# EAGLE schematic Myduino (EAGLE 7.6.0)
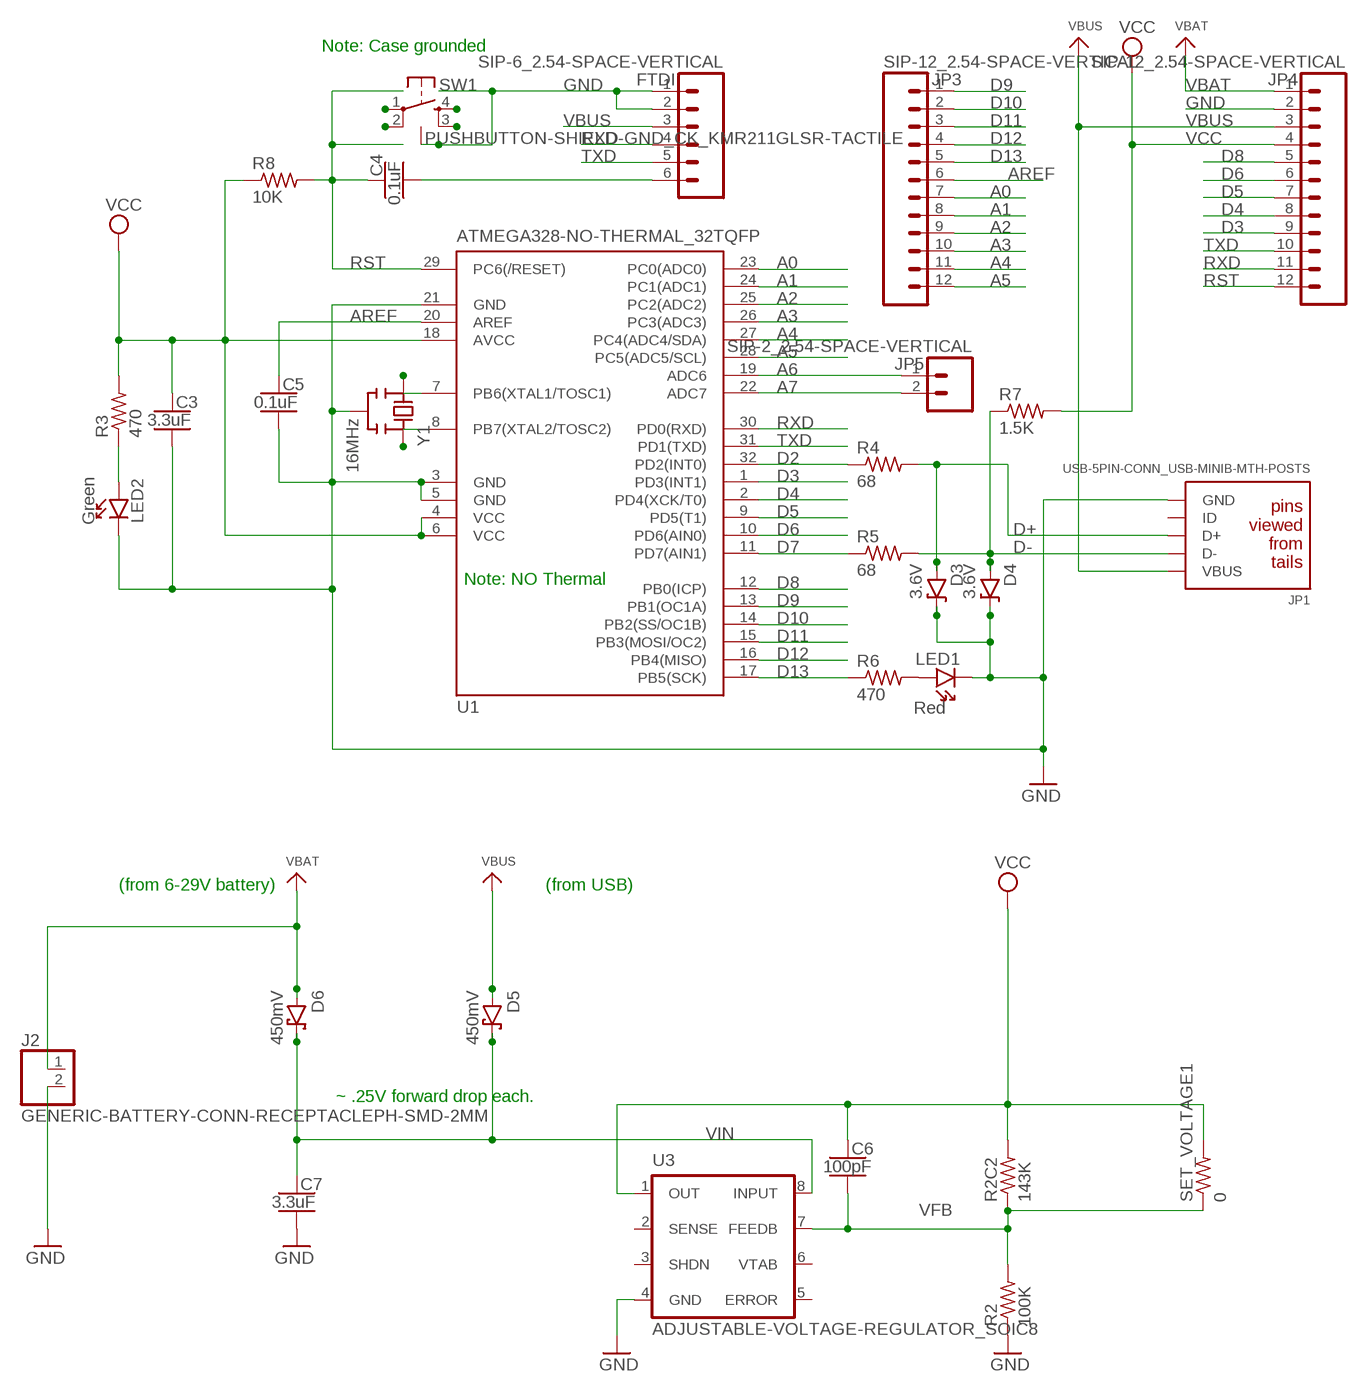
[diagram p0: schematic, sheet 1]

## Parts
C3  3.3uF  RESOLVED-CAPACITOR-NP_SMD-2012-0805_CERAMIC  [CAPC2012X140_HS]
C4  0.1uF  RESOLVED-CAPACITOR-NP_TH-FK26_CERAMIC  [CAPRB500W53L600T350H600_HS]
C5  0.1uF  RESOLVED-CAPACITOR-NP_TH-FK26_CERAMIC  [CAPRB500W53L600T350H600_HS]
C6  100pF  RESOLVED-CAPACITOR-NP_TH-FK24-FK28_CERAMIC  [CAPRB500W53L550T250H550_HS]
C7  3.3uF  RESOLVED-CAPACITOR-NP_SMD-2012-0805_CERAMIC  [CAPC2012X140_HS]
D3  3.6V  RESOLVED-DIODE-ZENER_TH-T18  [DIOAD1660W102L890D370_HS]
D4  3.6V  RESOLVED-DIODE-ZENER_TH-T18  [DIOAD1660W102L890D370_HS]
D5  450mV  RESOLVED-DIODE-SCHOTTKY_TH-DO-41-AND-DO-204AL  [DIOAD1125W78L520D270_HS]
D6  450mV  RESOLVED-DIODE-SCHOTTKY_TH-DO-41-AND-DO-204AL  [DIOAD1125W78L520D270_HS]
FTDI  SIP-6_2.54-SPACE-VERTICAL  [HDRV6W63P254_6X1_1524X254H838]
J2  GENERIC-BATTERY-CONN-RECEPTACLEPH-SMD-2MM  [JST_S2B-PH-SM4-TB]
JP1  USB-5PIN-CONN_USB-MINIB-MTH-POSTS  [FCI_10033526]
JP3  SIP-12_2.54-SPACE-VERTICAL  [HDRV12W63P254_12X1_3048X254H838]
JP4  SIP-12_2.54-SPACE-VERTICAL  [HDRV12W63P254_12X1_3048X254H838]
JP5  SIP-2_2.54-SPACE-VERTICAL  [HDRV2W63P254_2X1_508X254H838]
LED1  Red  RESOLVED-DIODE-LED_TH-ROHM-4X6-ROUND  [LEDRD250W50D400H640_HS]
LED2  Green  RESOLVED-DIODE-LED_TH-ROHM-4X6-ROUND  [LEDRD250W50D400H640_HS]
R2  100K  RESOLVED-RESISTOR_TH-1/4W-CARBON  [RESAD1160W55L680D260_HS]
R2C2  143K  RESOLVED-RESISTOR_TH-1/4W-CARBON  [RESAD1160W55L680D260_HS]
R3  470  RESOLVED-RESISTOR_TH-1/6W-CARBON  [RESAD770W45L370D210_HS]
R4  68  RESOLVED-RESISTOR_TH-1/6W-CARBON  [RESAD770W45L370D210_HS]
R5  68  RESOLVED-RESISTOR_TH-1/6W-CARBON  [RESAD770W45L370D210_HS]
R6  470  RESOLVED-RESISTOR_TH-1/6W-CARBON  [RESAD770W45L370D210_HS]
R7  1.5K  RESOLVED-RESISTOR_TH-1/6W-CARBON  [RESAD770W45L370D210_HS]
R8  10K  RESOLVED-RESISTOR_TH-1/6W-CARBON  [RESAD770W45L370D210_HS]
SET_VOLTAGE1  0  RESOLVED-RESISTOR_TH-1/6W-CARBON  [RESAD770W45L370D210_HS]
SW1  PUSHBUTTON-SHIELD-GND_CK_KMR211GLSR-TACTILE  [CK_KMR211GLSR]
U1  ATMEGA328-NO-THERMAL_32TQFP  [QFP80P900X900X120-32L30HS]
U3  ADJUSTABLE-VOLTAGE-REGULATOR_SOIC8  [SOIC127P600X175-8L86HS]
Y1  16MHz  RESOLVED-RESONATOR_TH-CTS8-X  [MURATA_CTLS8_X_SERIES_HS]

## Nets
A0: JP3.7 U1.23(PC0(ADC0))
A1: JP3.8 U1.24(PC1(ADC1))
A2: JP3.9 U1.25(PC2(ADC2))
A3: JP3.10 U1.26(PC3(ADC3))
A4: JP3.11 U1.27(PC4(ADC4/SDA))
A5: JP3.12 U1.28(PC5(ADC5/SCL))
A6: JP5.1 U1.19(ADC6)
A7: JP5.2 U1.22(ADC7)
AREF: C5.1 JP3.6 U1.20(AREF)
D2: R4.1 U1.32(PD2(INT0))
D3: JP4.9 U1.1(PD3(INT1))
D4: JP4.8 U1.2(PD4(XCK/T0))
D5: JP4.7 U1.9(PD5(T1))
D6: JP4.6 U1.10(PD6(AIN0))
D7: R5.1 U1.11(PD7(AIN1))
D8: JP4.5 U1.12(PB0(ICP))
D9: JP3.1 U1.13(PB1(OC1A))
D10: JP3.2 U1.14(PB2(SS/OC1B))
D11: JP3.3 U1.15(PB3(MOSI/OC2))
D12: JP3.4 U1.16(PB4(MISO))
D13: JP3.5 R6.1 U1.17(PB5(SCK))
D+: D3.A JP1.3(D+) R4.2
D-: D4.A JP1.2(D-) R5.2 R7.1
DTR/RTS: C4.2 FTDI.6
GND: C3.2 C5.2 C7.2 D3.C D4.C FTDI.1 FTDI.2 J2.2 JP1.5(GND) JP4.2 LED1.C LED2.C R2.1 SW1.1 SW1.4 SW1.5 U1.3(GND) U1.5(GND) U1.21(GND) U3.4(GND) Y1.2(GND)
N$2: LED1.A R6.2
N$4: U1.8(PB7(XTAL2/TOSC2)) Y1.1(OSC2)
N$5: U1.7(PB6(XTAL1/TOSC1)) Y1.3(OSC1)
N$6: LED2.A R3.1
RST: C4.1 JP4.12 R8.2 SW1.2 SW1.3 U1.29(PC6(/RESET))
RXD: FTDI.4 JP4.11 U1.30(PD0(RXD))
TXD: FTDI.5 JP4.10 U1.31(PD1(TXD))
VBAT: D6.A J2.1 JP4.1
VBUS: D5.A FTDI.3 JP1.1(VBUS) JP4.3
VCC: C3.1 C6.1 JP4.4 R2C2.2 R3.2 R7.2 R8.1 SET_VOLTAGE1.2 U1.4(VCC) U1.6(VCC) U1.18(AVCC) U3.1(OUT)
VFB: C6.2 R2.2 R2C2.1 SET_VOLTAGE1.1 U3.7(FEEDB)
VIN: C7.1 D5.C D6.C U3.8(INPUT)
Unconnected: JP1.4(ID) U3.2(SENSE) U3.3(SHDN) U3.5(ERROR) U3.6(VTAB)

## Notes on the sheet
- Note: Case grounded
- Note: NO Thermal
- (from 6-29V battery) | (from USB)
- ~ .25V forward drop each.

## Library data of the parts
C3 C7 = KoalaBuild:RESOLVED-CAPACITOR-NP_; VALUE_QUERY: 3.3uF; VOLTS: 35V; VOLTS_QUERY: 35V
C4 C5 = KoalaBuild:RESOLVED-CAPACITOR-NP_; VALUE_QUERY: 0.1uF
C6 = KoalaBuild:RESOLVED-CAPACITOR-NP_; VALUE_QUERY: 100pF
D3 D4 = KoalaBuild:RESOLVED-DIODE-ZENER_; VALUE_QUERY: 3.6
D5 D6 = KoalaBuild:RESOLVED-DIODE-SCHOTTKY_; VALUE_QUERY: <0.500V
FTDI = NVSL:SIP-6_; BREAKAWAY: 6 position; DIST1: DigiKey; DIST1PN: SAM1035-50-ND; MFR: Samtec; MPN: TSW-150-07-T-S
J2 = NVSL:GENERIC-BATTERY-CONN-RECEPTACLE; DIST1: DigiKey; DIST1PN: 455-1749-2-ND; MFR: JST; MPN: S2B-PH-SM4-TB(LF)(SN)
JP1 = NVSL:USB-5PIN-CONN_; DIST1: DigiKey; DIST1PN: 609-4701-1-ND; MFR: FCI; MPN: 10033526-N3212MLF
JP3 = NVSL:SIP-12_; BREAKAWAY: 12 position; DIST1: DigiKey; DSIST-1-PN: SAM1035-50-ND; MFR: Samtec; MPN: TSW-150-07-T-S
JP4 = NVSL:SIP-12_; BREAKAWAY: 12 position; DIST1: DigiKey; DIST1PN: SAM1035-50-ND; MFR: Samtec; MPN: TSW-150-07-T-S
JP5 = NVSL:SIP-2_; BREAKAWAY: 2 position; DIST1: DigiKey; DIST1PN: SAM1035-50-ND; MFR: Samtec; MPN: TSW-150-07-T-S
LED1 = KoalaBuild:RESOLVED-DIODE-LED_; VALUE_QUERY: Red
LED2 = KoalaBuild:RESOLVED-DIODE-LED_; VALUE_QUERY: Green
R2 = KoalaBuild:RESOLVED-RESISTOR_; TOL: 1%; TOL_QUERY: 1%; VALUE_QUERY: 100K
R2C2 = KoalaBuild:RESOLVED-RESISTOR_; TOL: 1%; TOL_QUERY: 1%; VALUE_QUERY: 143K
R3 R6 = KoalaBuild:RESOLVED-RESISTOR_; VALUE_QUERY: 470
R4 R5 = KoalaBuild:RESOLVED-RESISTOR_; VALUE_QUERY: 68
R7 = KoalaBuild:RESOLVED-RESISTOR_; VALUE_QUERY: 1.5K
R8 = KoalaBuild:RESOLVED-RESISTOR_; VALUE_QUERY: 10K
SET_VOLTAGE1 = KoalaBuild:RESOLVED-RESISTOR_; TOL: 1%; TOL_QUERY: 1%
SW1 = NVSL:PUSHBUTTON-SHIELD-GND_; DIST1: DigiKey; DIST1PN: 401-1426-1-ND; MFR: C&K; MPN: KMR211GLFS
U1 = NVSL:ATMEGA328-NO-THERMAL_; DIST1: DigiKey; DIST1PN: ATMEGA328-AU-ND; MFR: Atmel; MPN: ATMEGA328-AU
U3 = NVSL:ADJUSTABLE-VOLTAGE-REGULATOR_; DIST1: DigiKey; DIST1PN: 576-1149-1-ND; IFWD: 150ma; MFR: Micrel; MPN: MIC2951-03YM; VFWD: 0.3V
Y1 = KoalaBuild:RESOLVED-RESONATOR_; CAP: 15pF; STBL: 0.002; VALUE_QUERY: 16 MHz

## Net classes
1 power: width 0.305 mm